# Altium schematic sheet MAIN POWER.SchDoc
size A4
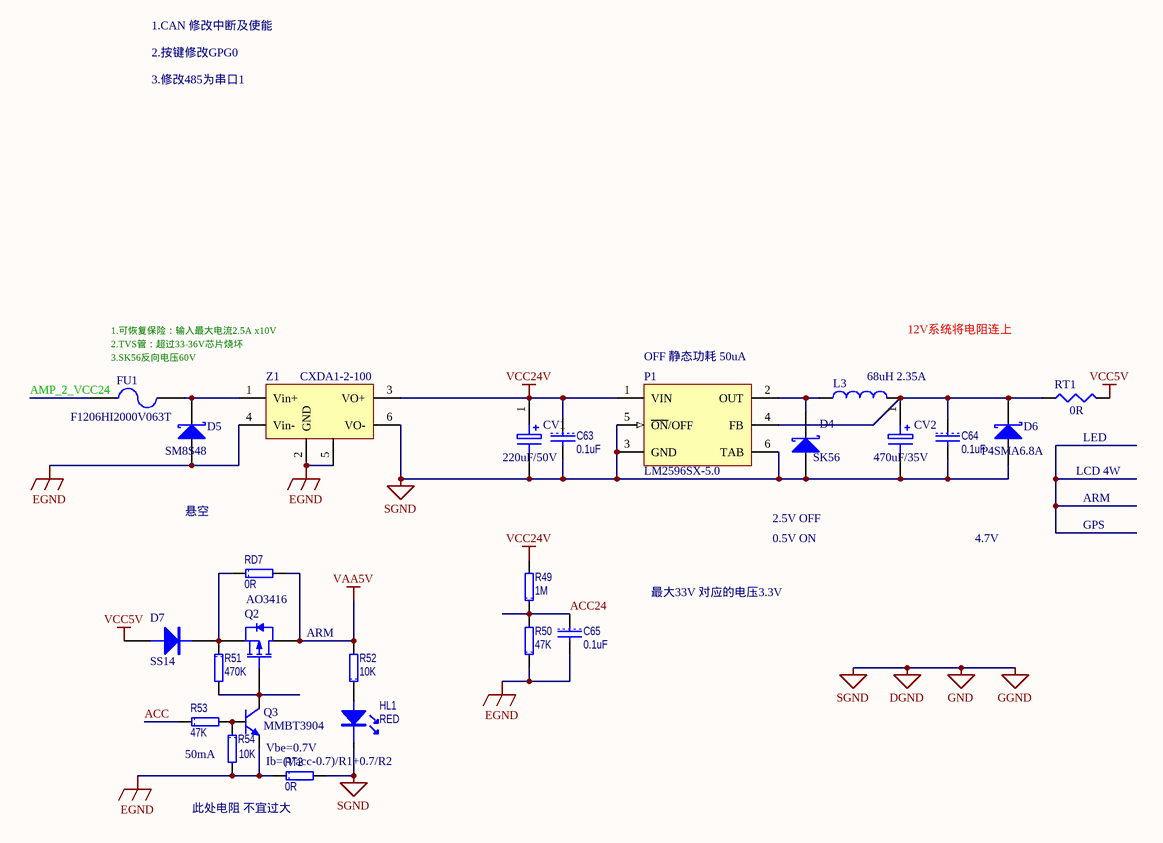
[diagram p0: MAIN POWER.SchDoc]

## Parts
C63  0.1uF  [1608[0603]]
C64  0.1uF  [1608[0603]]
C65  0.1uF  [1608[0603]]
CV1  220uF/50V  [CAPPR5-10x20/H1.1]
CV2  470uF/35V  [CAPPR5-10x20/H1.1]
D4  SK56  [DIODE_SMC]
D5  SM8S48  [DIODE_SMC]
D6  P4SMA6.8A  [SMA]
D7  SS14  [SMA]
FU1  F1206HI2000V063T  [RAD-0.3]
HL1  RED  [0805LED]
L3  value 68uH 2.35A  [INDP125125X85N]  (hidden comment: B82477P4683M000)
P1  LM2596SX-5.0  [TS5B_N]
Q2  AO3416  [SOT23_N]
Q3  MMBT3904  [SOT23-NPN]
R49  1M  [1608[0603]R]
R50  47K  [1608[0603]R]
R51  470K  [1608[0603]R]
R52  10K  [1608[0603]R]
R53  47K  [1608[0603]R]
R54  10K  [1608[0603]R]
RD7  0R  [1608[0603]RD]
RT1  0R  [2012[0805]]
RT2  0R  [1608[0603]RD]
Z1  CXDA1-2-100  [CXDA1-2-100]

## Nets
DGND: C63.2 C64.2 CV1.2 CV2.2 D4.1(A) D6.1(A) HL1.2 P1.3(GND) P1.5(~{ON}/OFF) P1.6(TAB) RT2.2 Z1.6(VO-)  [also labelled GGND, GND, SGND]
EGND: C65.2 D5.1(A) Q3.1 R50.1 R54.2 RT2.1 Z1.2(GND) Z1.4(Vin-) Z1.5(GND)
VAA5V: Q2.3(D) R52.2 RD7.2
VCC5V: D7.1(A) RT1.2
VCC24V: C63.1 CV1.1 P1.1(VIN) R49.2 Z1.3(VO+)
ACC: R53.1
ACC24: C65.1 R49.1 R50.2
AMP_2_VCC24: FU1.1
NetC64_1: C64.1 CV2.1 D6.2(K) L3.2 P1.4(FB) RT1.1
NetD4_2: D4.2(K) L3.1 P1.2(OUT)
NetD5_2: D5.2(K) FU1.2 Z1.1(Vin+)
NetD7_2: D7.2(K) Q2.2(S) R51.1 RD7.1
NetHL1_1: HL1.1 R52.1
NetQ2_1: Q2.1(G) Q3.3 R51.2
NetQ3_2: Q3.2 R53.2 R54.1

## Notes on the sheet
- 1.CAN 修改中断及使能
- 2.按键修改GPG0
- 3.修改485为串口1
- 1.可恢复保险：输入最大电流2.5A x10V
- 2.TVS管：超过33-36V芯片烧坏
- (near FU1) 3.SK56反向电压60V
- (near P1) OFF 静态功耗 50uA
- 12V系统将电阻连上
- (near RT1) LED
- LCD 4W
- ARM
- 悬空
- 2.5V OFF
- 0.5V ON
- 4.7V
- GPS
- 最大33V 对应的电压3.3V
- 50mA
- (near Q3) Vbe=0.7V
- Ib=(Vacc-0.7)/R1+0.7/R2
- 此处电阻 不宜过大

## Library data of the parts
C63-C65 = CAP: Capacitor; Manufacturer: TDK; Type: 无铅电容; Model: C0603X7R1H104K; Value: 0.1uF
CV1 = ELECTRO1: aluminum electrolytic capacitor; Manufacturer: Yageo; Value: 220uF; Model: SL050K0220A5S-1019; Parameter: 220uF/50V
CV2 = ELECTRO1: aluminum electrolytic capacitor; Manufacturer: Yageo; Value: 470uF; Model: SL050K0220A5S-1019; Parameter: 470uF/35V
D4 = D Schottky: 肖特基二极管; Published: 8-Jun-2000; LatestRevisionDate: 17-Jul-2002; LatestRevisionNote: Re-released for DXP Platform.; PackageReference: SMB; Publisher: Altium Limited; PackageDescription: DO-214-AA/SMB; 2 C-Bend Leads; Body 5.3 x 3.6 mm, inc. leads (LxW); Code_JEDEC: DO-214-AA
D5 D6 = 30BQ040: TVS; 公司: Vishay; Published: 8-Jun-2000; LatestRevisionDate: 17-Jul-2002; LatestRevisionNote: Re-released for DXP Platform.; DatasheetVersion: PD-2.439; PackageReference: SMC; Publisher: Altium Limited; PackageDescription: DO-214-AB/SMC; 2 C-Bend Leads; Body 7.9 x 5.9 mm, inc. leads (LxW); Code_JEDEC: DO-214-AB; ComponentLink1Description: Manufacturer Link; ComponentLink1URL: http://www.irf.com/; ComponentLink2Description: Datasheet; ComponentLink2URL: http://www.irf.com/product-info/datasheets/data/30bq040.pdf; 参数: *
D7 = DIODE
FU1 = Fuse 2: FUSE; 公司: 美国泰科; 参数: 63V 2A; Published: 8-Jun-2000; LatestRevisionDate: 17-Jul-2002; LatestRevisionNote: Re-released for DXP Platform.; PackageReference: PIN-W2/E2.8; Publisher: Altium Limited; PackageDescription: Thru-Hole; 2 Leads
HL1 = LED: 发光管; Votage: 1.82-1.88V; I: 5-8mA
L3 = Inductor: Code_IEC: 1005; parameters: 3.5A; 公司: epcos; Published: 8-Jun-2000; LatestRevisionDate: 29-May-2009; LatestRevisionNote: IPC-7351 Footprint Added.; PackageReference: 0402-A; Publisher: Altium Limited; PackageDescription: Chip Inductor; Code_JEITA: 0402; Manufacturer: *
P1 = LM2596SX-12: POWER; Manufacturer: National Semiconductor; PackageTopMarking: NSUZXYTTE#*LM2596S*-12 P+; PowerWise: N; CompType: Switcher; Published: 1-Mar-2010; DatasheetVersion: May-2002; PackageVersion: revD, Apr-2005; PackageReference: TS5B; Publisher: Altium Limited; PackageDescription: TO-263, Molded, .400 x .390 x .180in, 5 Lead, .067in Pitch, Surface Mount; PartNumber: LM2596SX-12; RoHS: N; PinCount: 5; Code_JEDEC: MO-169-AB; ComponentLink1Description: LM2596 Datasheet; ComponentLink1URL: http://www.national.com/ds/LM/LM2596.pdf; ComponentLink2Description: LM2596 Web Page; ComponentLink2URL: http://www.national.com/pf/LM/LM2596.html; ComponentLink3Description: TS5B Package Page; ComponentLink3URL: http://www.national.com/packaging/folders/ts5b.html; Supplier 1: Digi-Key; Supplier Part Number 1: LM2596SX-12-ND
Q2 = BSH205: P-channel Enhancement Mode MOSFET; Published: 17-Sep-2003; LatestRevisionDate: 12-Dec-2006; LatestRevisionNote: IPC-7351 Footprint Added.; DatasheetVersion: Aug-1998; PackageVersion: May-1999; PackageReference: SOT23; Publisher: Altium Limited; PackageDescription: 3-Pin SOT-23 Package 0.95 mm Pitch, 2.3 mm Lead Span; ComponentLink1Description: Manufacturer Link; ComponentLink1URL: http://www.semiconductors.philips.com/; ComponentLink2Description: Datasheet; ComponentLink2URL: http://www.semiconductors.philips.com/acrobat/datasheets/BSH205_3.pdf
R49 = RES: Manufacturer: vishay; Model: CRCW06031M0KKEDTR; Value: 1M; Type: 无铅电阻
R50 R51 = RES: Manufacturer: vishay; Model: CRCW0603470K0KKEDTR; Type: 无铅电阻
  R50: Value: 47K
  R51: Value: 470K
R52 = RES: Manufacturer: vishay; Model: CRCW060310K0KKEDTR; Value: 10K; Type: 无铅电阻
R53 = RES: Manufacturer: vishay; Model: CRCW060347K0KKEDTR; Value: 47K; Type: 无铅电阻
R54 = RES: Manufacturer: vishay; Model: CRCW060310K0KKEDTR; Parameters: 50V 1/10W 0.5%; Type: 无铅电阻; Value: 10K
RD7 = RES: Manufacturer: vishay; Model: RT0603DRD7D0RL; Value: 0R; Type: 无铅电阻
RT1 = Res3: 电阻; Manufacturer: Yageo; Model: RT0805DRD7D0RL; Published: 8-Jun-2000; LatestRevisionDate: 29-May-2009; LatestRevisionNote: IPC-7351 Footprint Added.; PackageReference: J1-0603; Publisher: Altium Limited; PackageDescription: Chip Resistor; Value: 0R; Type: RES
RT2 = RES: Manufacturer: vishay; Model: CRCW06030R0KKEDTR; Value: 0R; Type: 无铅电阻
Z1 = CXDB: Filter; 公司: 中北创新